# EAGLE design mainBoard (EAGLE 9.6.2)
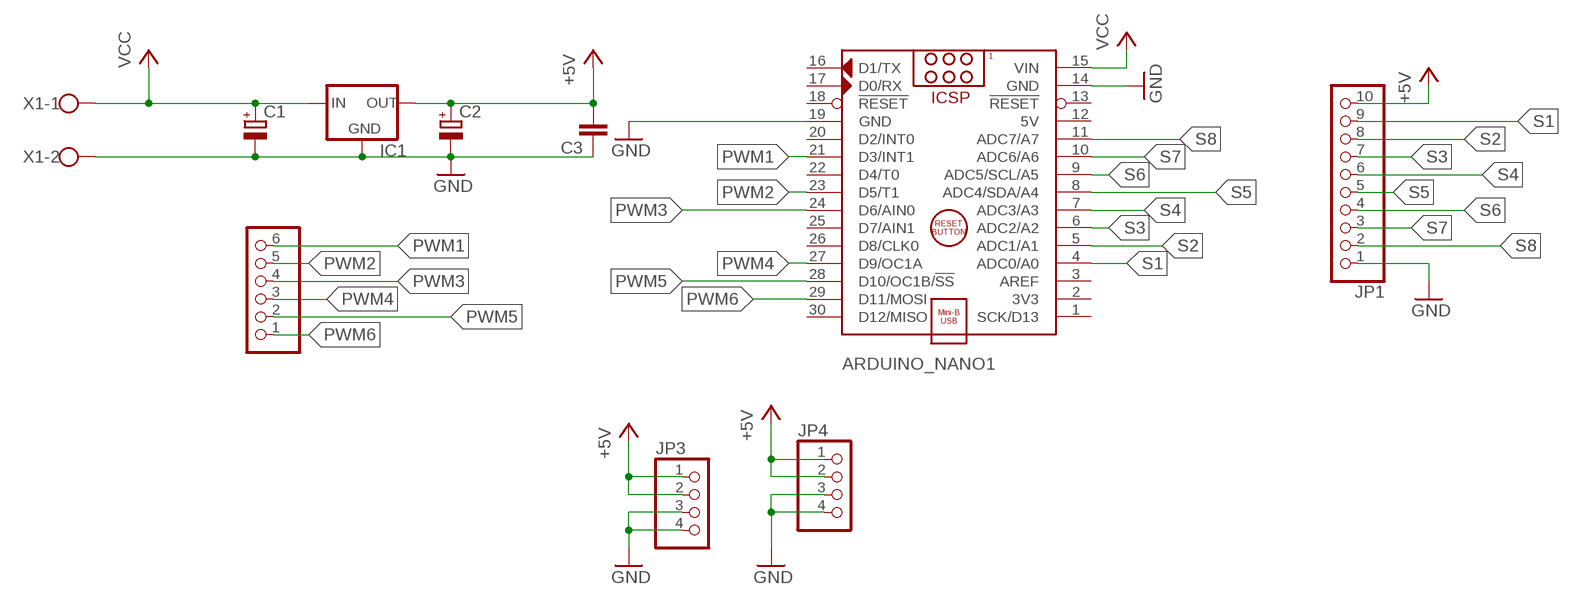
[diagram p0: schematic, sheet 1]

## Parts
ARDUINO_NANO1  ARDUINO_NANO  [ARDUINO_NANO]
C1  CPOL-EUE2-5  [E2-5]
C2  CPOL-EUE2-5  [E2-5]
C3  C-EU050-025X075  [C050-025X075]
IC1  78MXXS  [78MXXS]
JP1  PINHD-1X10  [1X10]
JP2  PINHD-1X6  [1X06]
JP3  PINHD-1X4  [1X04]
JP4  PINHD-1X4  [1X04]
X1  W237-102  [W237-102]

## Nets
+5V: C2.+ C3.2 IC1.OUT JP1.10 JP3.1 JP3.2 JP4.1 JP4.2
GND: ARDUINO_NANO1.14(GND) ARDUINO_NANO1.19(GND) C1.- C2.- C3.1 IC1.GND JP1.1 JP3.3 JP3.4 JP4.3 JP4.4 X1.2
PWM1: ARDUINO_NANO1.21(D3/INT1) JP2.6
PWM2: ARDUINO_NANO1.23(D5/T1) JP2.5
PWM3: ARDUINO_NANO1.24(D6/AIN0) JP2.4
PWM4: ARDUINO_NANO1.27(D9/OC1A) JP2.3
PWM5: ARDUINO_NANO1.28(D10/OC1B/!SS) JP2.2
PWM6: ARDUINO_NANO1.29(D11/MOSI) JP2.1
S1: ARDUINO_NANO1.4(ADC0/A0) JP1.9
S2: ARDUINO_NANO1.5(ADC1/A1) JP1.8
S3: ARDUINO_NANO1.6(ADC2/A2) JP1.7
S4: ARDUINO_NANO1.7(ADC3/A3) JP1.6
S5: ARDUINO_NANO1.8(ADC4/SDA/A4) JP1.5
S6: ARDUINO_NANO1.9(ADC5/SCL/A5) JP1.4
S7: ARDUINO_NANO1.10(ADC6/A6) JP1.3
S8: ARDUINO_NANO1.11(ADC7/A7) JP1.2
VCC: ARDUINO_NANO1.15(VIN) C1.+ IC1.IN X1.1
Unconnected: ARDUINO_NANO1.1(SCK/D13) ARDUINO_NANO1.2(3V3) ARDUINO_NANO1.3(AREF) ARDUINO_NANO1.13(!RESET) ARDUINO_NANO1.16(D1/TX) ARDUINO_NANO1.17(D0/RX) ARDUINO_NANO1.18(!RESET) ARDUINO_NANO1.20(D2/INT0) ARDUINO_NANO1.22(D4/T0) ARDUINO_NANO1.25(D7/AIN1) ARDUINO_NANO1.26(D8/CLK0) ARDUINO_NANO1.30(D12/MISO)

## Power pins joined to a net without a drawn wire
5V: ARDUINO_NANO1.12(5V)

## Library data of the parts
ARDUINO_NANO1 = ArduinoNanoV30:ARDUINO_NANO: Arduino Nano V3.0 Module Overview: The Arduino Nano is a small, complete, and breadboard-friendly board based on the ATmega328 (Arduino Nano 3.x) or ATmega168 (Arduino Nano 2.x). It has more or less the same functionality of the Arduino Duemilanove, but in a different package. It lacks only a DC power jack, and works with a Mini-B USB cable instead of a standard one. The Nano was designed and is being produced by Gravitech <http://www.gravitech.us/arna30wiatp.html>. General specifications: Item Value Microcontroller Atmel ATmega168 or ATmega328 Operating Voltage (logic level) 5 V Input Voltage (recommended) 7-12 V Input Voltage (limits) 6-20 V Digital I/O Pins 14 (of which 6 provide PWM output) Analog Input Pins 8 DC Current per I/O Pin 40 mA Flash Memory 16 KB (ATmega168) or 32 KB (ATmega328) of which 2 KB used by bootloader SRAM 1 KB (ATmega168) or 2 KB (ATmega328) EEPROM 512 bytes (ATmega168) or 1 KB (ATmega328) Clock Speed 16 MHz Dimensions (Inches) 0.73" x 1.70" Dimensions (mm) 18mm x 45mm Overall height About 9 mm (not including pins) Weigth 5 g Power: The Arduino Nano can be powered via the Mini-B USB connection, 6-20V unregulated external power supply (pin 30), or 5V regulated external power supply (pin 27). The power source is automatically selected to the highest voltage source. Memory: The ATmega168 has 16 KB of flash memory for storing code (of which 2 KB is used for the bootloader); the ATmega328 has 32 KB, (also with 2 KB used for the bootloader). The ATmega168 has 1 KB of SRAM and 512 bytes of EEPROM (which can be read and written with the EEPROM library); the ATmega328 has 2 KB of SRAM and 1 KB of EEPROM. Input and Output: Each of the 14 digital pins on the Nano can be used as an input or output, using pinMode(), digitalWrite(), and digitalRead() functions. They operate at 5 volts. Each pin can provide or receive a maximum of 40 mA and has an internal pull-up resistor (disconnected by default) of 20-50 kOhms. In addition, some pins have specialized functions. Visit Arduino - ArduinoBoardNano <https://www.arduino.cc/en/Main/ArduinoBoardNano>
C1 C2 = rcl:CPOL-EU: POLARIZED CAPACITOR, European symbol; SPICEPREFIX: C
C3 = rcl:C-EU: CAPACITOR, European symbol; SPICEPREFIX: C
IC1 = v-reg:78MXXS: VOLTAGE REGULATOR
JP1 = pinhead:PINHD-1X10: PIN HEADER
JP2 = pinhead:PINHD-1X6: PIN HEADER
JP3 JP4 = pinhead:PINHD-1X4: PIN HEADER
X1 = con-wago-500:W237-102: WAGO SCREW CLAMP; MPN: 237-102; OC_FARNELL: unknown; OC_NEWARK: 70K9898

## Board
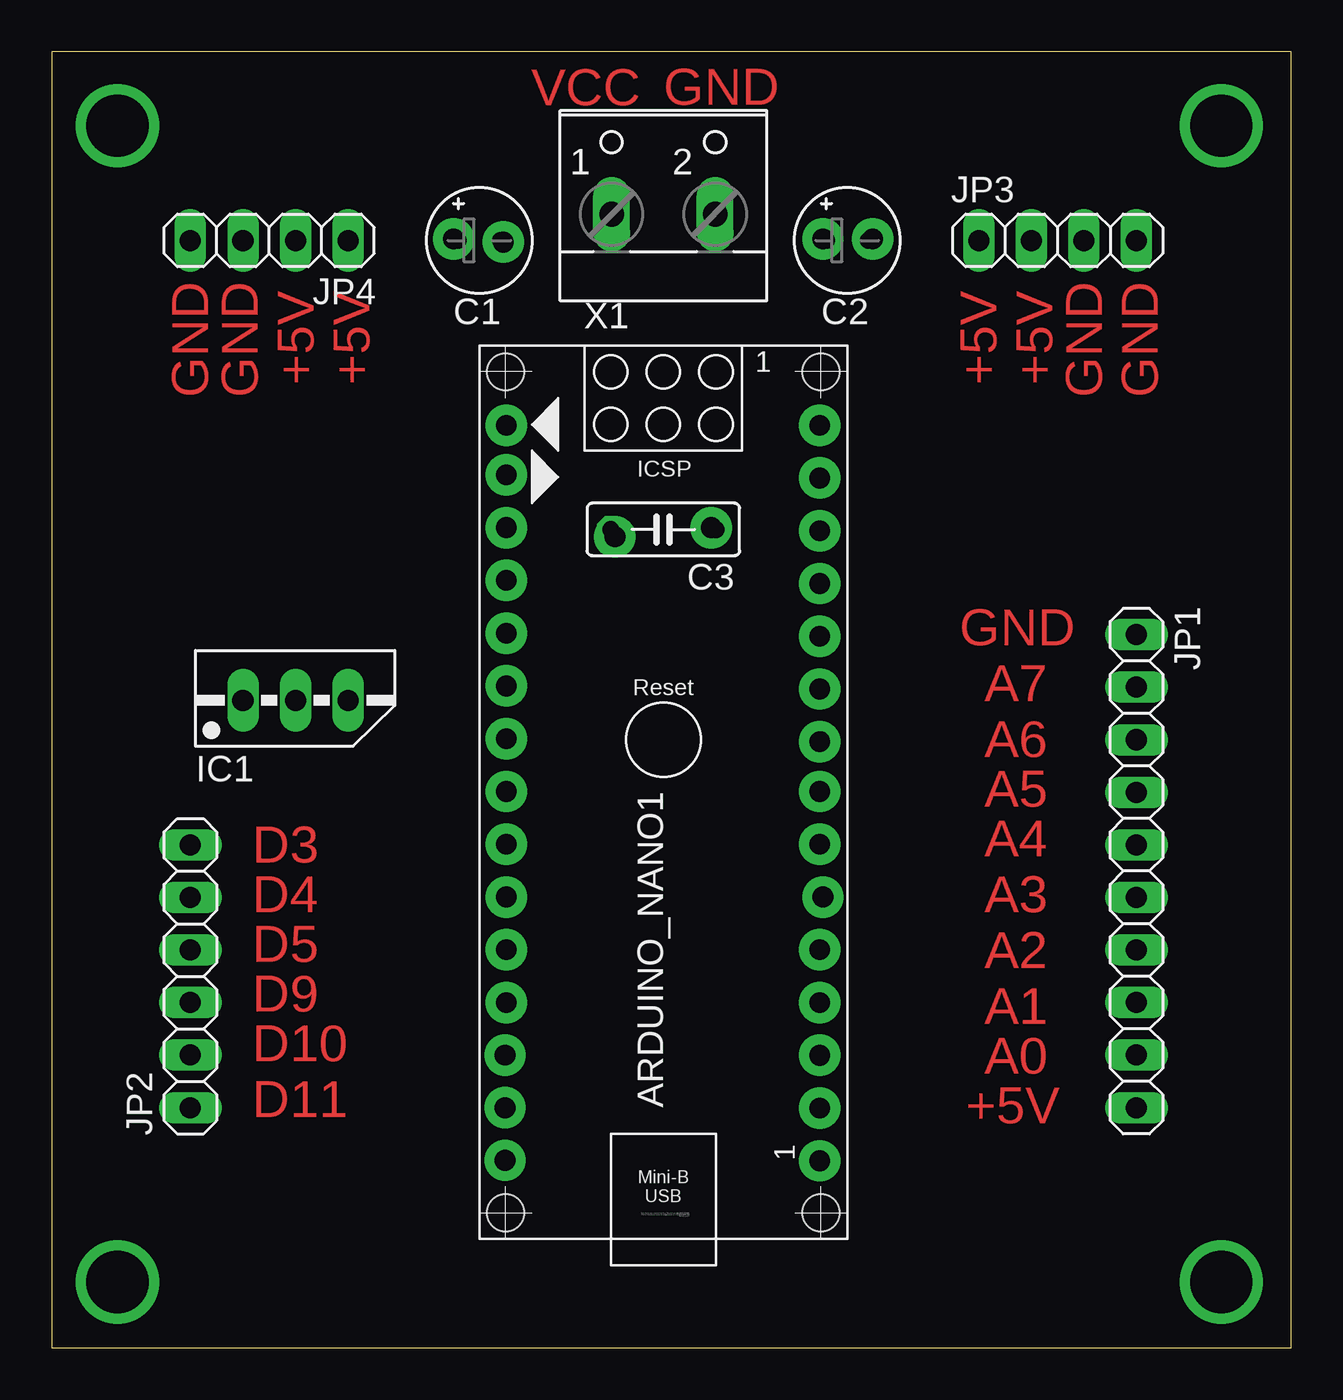
[diagram p1: board, top side]
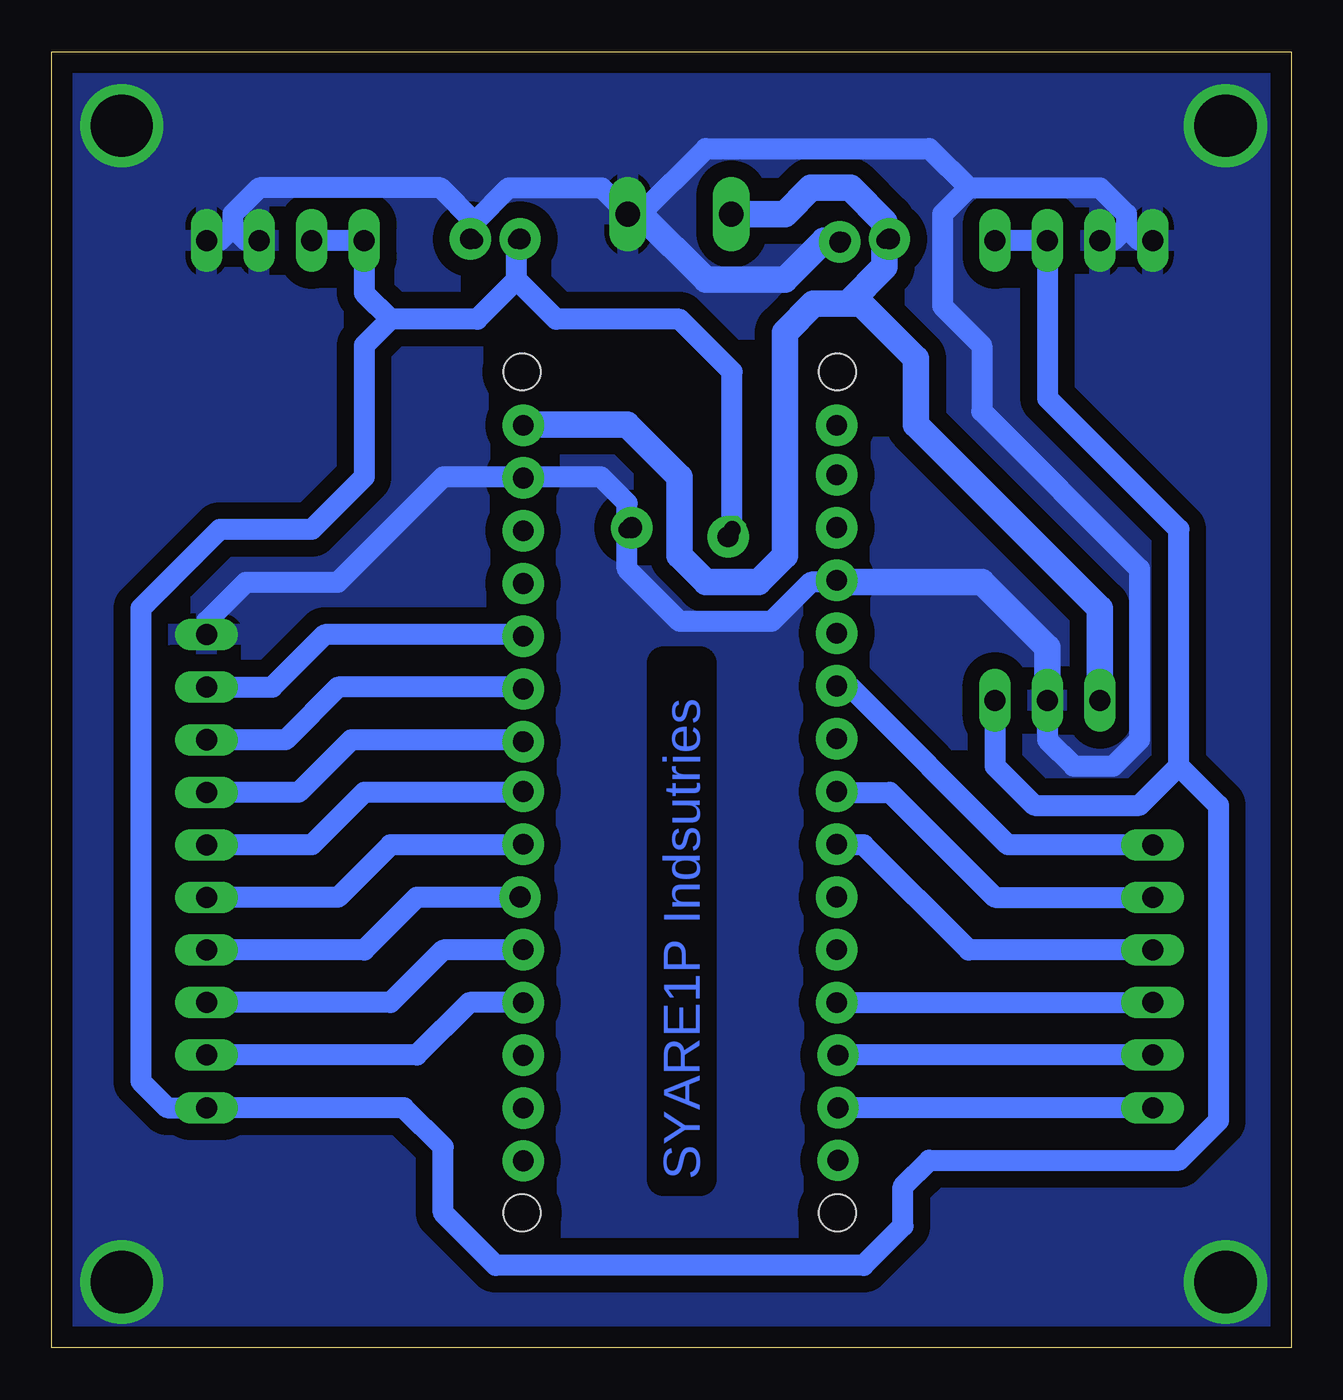
[diagram p2: board, bottom side, seen from below]

Size 59.91 x 62.63 mm. Coordinates in mm from the lower left corner, seen from the top.
Outline: 0,0 59.91,0 59.91,62.63 0,62.63 0,0
Copper layers (1*16): Top 0.035mm / dielectric 1.5mm / Bottom 0.035mm
Design rules "default": minimum track width 6mil, minimum drill 0.35mm, track to track 6mil, track to pad 6mil, pad to pad 6mil, via to via 6mil, smd to smd 6mil, copper to edge 40mil, drill to drill 6mil, minimum pad ring 10mil, minimum via ring 8mil, stop-mask expansion 4mil, vias tented up to drill 0mil, thermal gap 10mil

### Footprints (pad centres in the part's own frame; a part is rotated, then mirrored left to right if it is on the bottom)
ARDUINO_NANO = drill 0.8 square: 1 -20.32,-7.62 | drill 0.8: 2 -17.78,-7.62; 3 -15.24,-7.62; 4 -12.7,-7.62; 5 -10.16,-7.62; 6 -7.62,-7.62; 7 -5.08,-7.62; 8 -2.54,-7.62; 9 0,-7.62; 10 2.54,-7.62; 11 5.08,-7.62; 12 7.62,-7.62; 13 10.16,-7.62; 14 12.7,-7.62; 15 15.24,-7.62; 16 15.24,7.62; 17 12.7,7.62; 18 10.16,7.62; 19 7.62,7.62; 20 5.08,7.62; 21 2.54,7.62; 22 0,7.62; 23 -2.54,7.62; 24 -5.08,7.62; 25 -7.62,7.62; 26 -10.16,7.62; 27 -12.7,7.62; 28 -15.24,7.62; 29 -17.78,7.62; 30 -20.32,7.62 | hole 1.778: -22.86,-7.62; -22.86,7.62; 17.78,7.62; 17.78,-7.62
E2-5 = drill 0.813 pad 1.27: + -1.016,0 | drill 0.813 pad 1.27 octagon: - 1.016,0
C050-025X075 = drill 0.813 octagon: 1 -2.54,0; 2 2.54,0
78MXXS = drill 1.016 long: GND 0,-2.54; IN -2.54,-2.54; OUT 2.54,-2.54
1X10 = drill 1.016 long: 1 -11.43,0; 2 -8.89,0; 3 -6.35,0; 4 -3.81,0; 5 -1.27,0; 6 1.27,0; 7 3.81,0; 8 6.35,0; 9 8.89,0; 10 11.43,0
1X06 = drill 1.016 long: 1 -6.35,0; 2 -3.81,0; 3 -1.27,0; 4 1.27,0; 5 3.81,0; 6 6.35,0
1X04 = drill 1.016 long: 1 -3.81,0; 2 -1.27,0; 3 1.27,0; 4 3.81,0
W237-102 = drill 1.194 long: 1 -2.5,-1.27; 2 2.5,-1.27

### Placement (x,y rotation side)
ARDUINO_NANO1  29.56,29.39 90 top
C1  20.67,53.52 0 top
C2  38.45,53.52 0 top
C3  29.56,39.54 180 top
IC1  11.78,33.83 0 top
JP1  52.42,23.04 270 top
JP2  6.7,17.96 90 top
JP3  48.61,53.52 0 top
JP4  10.51,53.52 180 top
X1  29.56,56.05 0 top

### Tracks (layer width: path | path; a pad name or v marks a point on that pad's centre or on a via)
+5V
  Bottom 1.016: 5.43,28.12 7.34,26.21 12.41,26.21 14.32,28.12 IC1.OUT | 5.43,28.12 5.43,39.54 11.78,45.89 JP4.2 JP4.1 | C3.2 27.02,47.16 29.56,49.7 35.53,49.7 37.43,51.61 | 37.43,51.61 C2.+ | 5.43,28.12 3.52,26.21 3.52,10.97 5.43,9.06 17.5,9.06 18.77,7.79 18.77,5.89 20.67,3.99 38.45,3.99 40.99,6.52 40.99,9.7 42.9,11.61 JP1.10 54.33,11.61 55.6,12.88 55.6,35.73 51.79,39.54 47.34,39.54 44.8,42.09 44.8,48.43 43.53,49.7 | 37.43,51.61 39.34,49.7 43.53,49.7 | JP3.2 JP3.1 44.8,50.98 43.53,49.7
GND  (via drill 3 pad 2)
  Bottom 1.016: 7.97,54.15 7.97,54.78 9.24,56.05 15.59,56.05 | 7.97,54.15 8.61,53.52 JP4.3 | 7.97,54.15 7.34,53.52 JP4.4 | 15.59,56.05 17.5,57.96 28.29,57.96 31.46,54.78 X1.2 33.33,56.05 37.82,56.05 39.47,54.4 | 39.47,54.4 C2.- | ARDUINO_NANO1.19 23.21,37 25.11,35.1 29.56,35.1 32.1,37.64 C3.1 32.1,40.81 33.37,42.09 ARDUINO_NANO1.14 40.99,42.09 46.07,37 50.52,37 52.42,35.1 JP1.1 | 39.47,54.4 41.12,56.05 49.88,56.05 51.15,54.78 51.15,54.15 | 51.15,54.15 50.52,53.52 JP3.3 | 51.15,54.15 51.79,53.52 JP3.4 | IC1.GND 11.78,29.39 10.51,28.12 8.61,28.12 7.34,29.39 7.34,37.64 14.96,45.26 14.96,48.43 16.86,50.34 16.86,54.78 15.59,56.05
  Bottom 1.27: ARDUINO_NANO1.19 14.96,37 11.78,33.83 IC1.GND | C1.- 22.57,53.52 24.48,51.61 28.29,51.61 31.46,54.78
  other vias: 3.17,3.17 56.52,3.17 56.52,59.05 3.17,59.05
  pour Bottom (isolate 0.813): -3.18,64.14 -3.18,-1.91 62.87,-1.91 62.87,65.41 -3.18,65.41
N$1  (via drill 1 pad 2)
  other vias: 21.91,9.06
N$2  (via drill 1 pad 2)
  other vias: 21.91,11.6
N$3  (via drill 1 pad 2)
  other vias: 21.91,14.14
N$4  (via drill 1 pad 2)
  other vias: 21.97,16.69
N$5  (via drill 1 pad 2)
  other vias: 21.97,19.24
N$6  (via drill 1 pad 2)
  other vias: 21.97,21.79
N$7  (via drill 1 pad 2)
  other vias: 21.97,24.34
N$8  (via drill 1 pad 2)
  other vias: 21.97,26.89
N$9  (via drill 1 pad 2)
  other vias: 21.97,29.44
N$10  (via drill 1 pad 2)
  other vias: 21.97,31.99
N$11  (via drill 1 pad 2)
  other vias: 21.97,44.59
N$12  (via drill 1 pad 2)
  other vias: 21.97,42.18
N$13  (via drill 1 pad 2)
  other vias: 21.97,39.63
N$14  (via drill 1 pad 2)
  other vias: 21.97,37.09
N$15  (via drill 1 pad 2)
  other vias: 21.97,34.53
N$16  (via drill 1 pad 2)
  other vias: 27.22,39.18
N$17  (via drill 1 pad 2)
  other vias: 31.87,39.63
N$18  (via drill 1 pad 2)
  other vias: 37.12,44.59
N$19  (via drill 1 pad 2)
  other vias: 37.12,42.03
N$20  (via drill 1 pad 2)
  other vias: 37.12,39.48
N$21  (via drill 1 pad 2)
  other vias: 37.12,36.93
N$22  (via drill 1 pad 2)
  other vias: 37.12,34.38
N$23  (via drill 1 pad 2)
  other vias: 37.12,31.84
N$24  (via drill 1 pad 2)
  other vias: 37.12,29.29
N$25  (via drill 1 pad 2)
  other vias: 37.12,26.89
N$26  (via drill 1 pad 2)
  other vias: 37.12,24.34
N$27  (via drill 1 pad 2)
  other vias: 37.12,9.04
N$28  (via drill 1 pad 2)
  other vias: 37.12,11.58
N$29  (via drill 1 pad 2)
  other vias: 37.12,14.13
N$30  (via drill 1 pad 2)
  other vias: 37.12,16.69
N$31  (via drill 1 pad 2)
  other vias: 37.12,19.24
N$32  (via drill 1 pad 2)
  other vias: 37.27,21.79
N$33  (via drill 1 pad 2)
  other vias: 19.42,53.59
N$34  (via drill 1 pad 2)
  other vias: 21.82,53.43
N$35  (via drill 1 pad 2)
  other vias: 39.67,53.59
N$36  (via drill 1 pad 2)
  other vias: 37.27,53.59
PWM1
  Bottom 1.016: JP2.6 13.68,24.31 21.3,31.93 ARDUINO_NANO1.21
PWM2
  Bottom 1.016: ARDUINO_NANO1.23 19.4,26.85 14.32,21.77 JP2.5
PWM3
  Bottom 1.016: JP2.4 15.59,19.23 20.67,24.31 ARDUINO_NANO1.24
PWM4
  Bottom 1.016: ARDUINO_NANO1.27 JP2.3
PWM5
  Bottom 1.016: JP2.2 ARDUINO_NANO1.28
PWM6
  Bottom 1.016: JP2.1 ARDUINO_NANO1.29
S1
  Bottom 1.016: ARDUINO_NANO1.4 39.72,16.69 42.26,14.14 JP1.9
S2
  Bottom 1.016: ARDUINO_NANO1.5 40.99,19.23 43.53,16.69 JP1.8
S3
  Bottom 1.016: ARDUINO_NANO1.6 42.26,21.77 44.8,19.23 JP1.7
S4
  Bottom 1.016: ARDUINO_NANO1.7 43.53,24.31 46.07,21.77 JP1.6
S5
  Bottom 1.016: ARDUINO_NANO1.8 44.8,26.85 47.34,24.31 JP1.5
S6
  Bottom 1.016: ARDUINO_NANO1.9 45.44,29.39 47.98,26.85 JP1.4
S7
  Bottom 1.016: ARDUINO_NANO1.10 46.07,31.93 48.61,29.39 JP1.3
S8
  Bottom 1.016: ARDUINO_NANO1.11 46.71,34.46 49.25,31.93 JP1.2
VCC
  Bottom 1.27: X1.1 24.48,54.78 23.21,56.05 21.3,56.05 19.65,54.4 C1.+ 19.65,52.24 21.43,50.47 | ARDUINO_NANO1.15 32.1,44.62 29.56,42.09 29.56,38.27 28.29,37 25.75,37 24.48,38.27 24.48,49.07 23.08,50.47 21.43,50.47 | 21.43,50.47 20.8,50.47 18.13,47.8 18.13,44.62 9.24,35.73 IC1.IN

### Text on the board
Top: GND | VCC | +5V | +5V | +5V | +5V | GND | GND | GND | GND | GND | A7 | A6 | A5 | D3 | A4 | D4 | A3 | D5 | A2 | D9 | A1 | D10 | A0 | D11 | +5V
Bottom: SYARE1P Indsutries